# EAGLE design RS232_NPN_PNP_4Pin_Conn_Rev_Alt (EAGLE 7.7.0)
RS232 Adapter using NPN and PNP Transistors
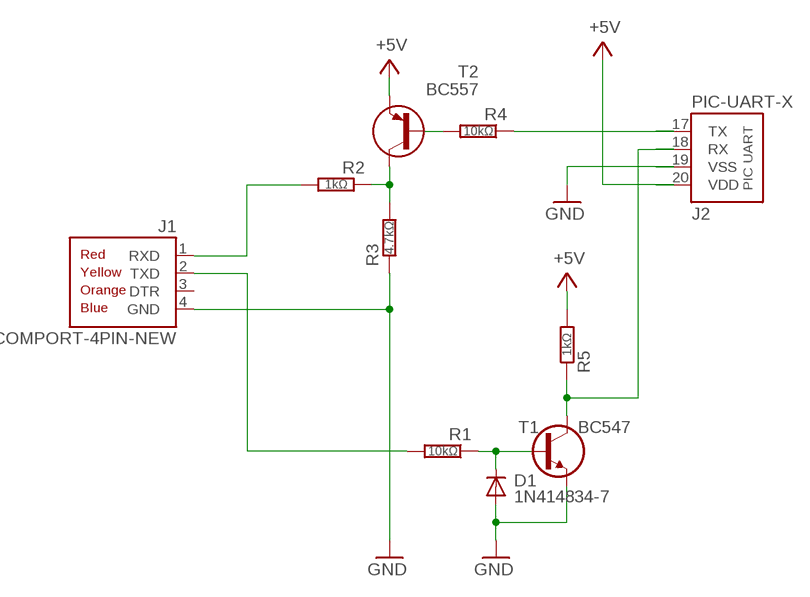
[diagram p0: schematic, sheet 1]

## Parts
D1  1N414834-7  [DO34-7]
J1  COMPORT-4PIN-NEW  [RS232-4PIN-NEW]
J2  PIC-UART-X  [PIC-UART-X]
R1  10kΩ  R0202/7  [0202/7]
R2  1kΩ  R0202/7  [0202/7]
R3  4.7kΩ  R0202/7  [0202/7]
R4  10kΩ  R0202/7-V  [0202/7-V]
R5  1kΩ  R0202/7-V  [0202/7-V]
T1  BC547  BC547CBE  [TO92-CBE]
T2  BC557  BC557CBE  [TO92-CBE]

## Nets
+5V: J2.20(VDD) R5.2 T2.E
GND: D1.A J1.4(GND) J2.19(VSS) R3.1 T1.E
N$1: J2.18(RX) R5.1 T1.C
N$2: D1.C R1.1 T1.B
N$3: J1.2(TXD) R1.2
N$4: J2.17(TX) R4.1
N$5: R4.2 T2.B
N$6: R2.1 R3.2 T2.C
N$7: J1.1(RXD) R2.2
Unconnected: J1.3(DTR)

## Library data of the parts
D1 = d:1N4148
J1 = pinconn:COMPORT-4PIN-NEW
J2 = pinconn:PIC-UART
R1-R5 = r:R: RESISTOR, European symbol
T1 = t:BC547
T2 = t:BC557

## Board
RS232 Adapter using NPN and PNP Transistors
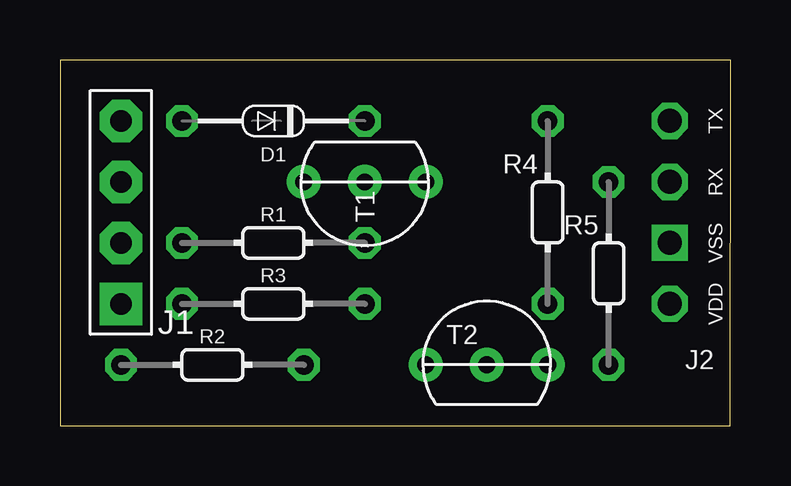
[diagram p1: board, top side]
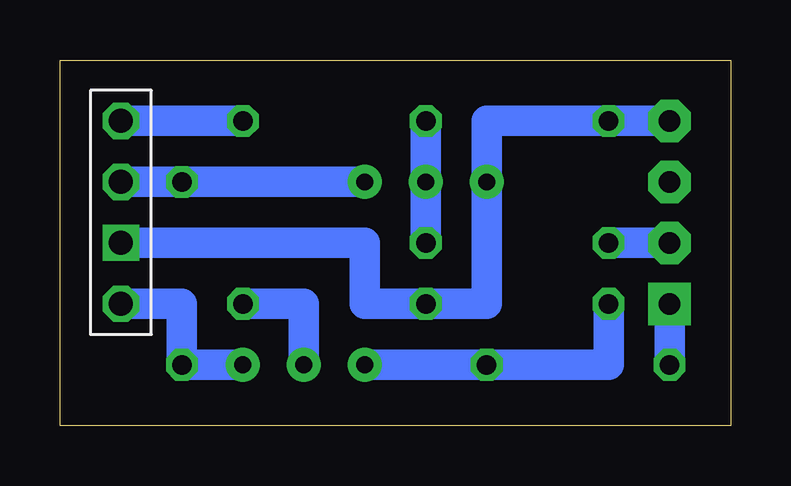
[diagram p2: board, bottom side, seen from below]

Size 27.94 x 15.24 mm. Coordinates in mm from the lower left corner, seen from the top.
Outline: 0,0 27.92,0 27.94,15.24 0,15.24 0,0
Copper layers (1*16): Top 0.035mm / dielectric 1.5mm / Bottom 0.035mm
Design rules "default": minimum track width 10mil, minimum drill 24mil, track to track 8mil, track to pad 8mil, pad to pad 8mil, via to via 8mil, smd to smd 8mil, copper to edge 40mil, drill to drill 8mil, minimum pad ring 10mil, minimum via ring 8mil, stop-mask expansion 4mil, vias tented up to drill 0mil, thermal gap 10mil

### Footprints (pad centres in the part's own frame; a part is rotated, then mirrored left to right if it is on the bottom)
DO34-7 = drill 0.813 octagon: A 3.81,0; C -3.81,0
RS232-4PIN-NEW = drill 0.9 pad 1.778 square: 1 0,-3.81 | drill 0.9 pad 1.778 octagon: 2 0,-1.27; 3 0,1.27; 4 0,3.81
PIC-UART-X = drill 1 octagon: 17 0,-3.81; 18 0,-1.27; 20 0,3.81 | drill 1 square: 19 0,1.27
0202/7 = drill 0.813 octagon: 1 -3.81,0; 2 3.81,0
0202/7-V = drill 0.813 octagon: 1 0,-3.81; 2 0,3.81
TO92-CBE = drill 0.7 pad 1.422: B 0,0; C 0,2.54; E 0,-2.54

### Placement (x,y rotation side)
D1  8.89,12.7 180 top
J1  2.54,8.89 0 top
J2  25.4,8.89 180 top
R1  8.89,7.62 180 top
R2  6.35,2.54 180 top
R3  8.89,5.08 180 top
R4  20.32,8.89 180 top
R5  22.86,6.35 180 top
T1  12.7,10.16 270 top
T2  17.78,2.54 90 top

### Tracks (layer width: path | path; a pad name or v marks a point on that pad's centre or on a via)
+5V
  Bottom 1.27: J2.20 22.86,5.08 R5.2 T2.E
GND
  Bottom 1.27: J2.19 15.24,7.62 15.24,5.08 R3.1 10.16,5.08 T1.E 10.16,12.7 D1.A J1.4
N$1
  Bottom 1.27: J2.18 R5.1 T1.C
N$2
  Bottom 1.27: R1.1 T1.B D1.C
N$3
  Bottom 1.27: J1.2 R1.2
N$4
  Bottom 1.27: R4.1 J2.17
N$5
  Bottom 1.27: T2.B 17.78,5.08 R4.2
N$6
  Bottom 1.27: R3.2 5.08,2.54 R2.1 T2.C
N$7
  Bottom 1.27: J1.1 R2.2